# EAGLE design bottom (EAGLE 6.5.0)
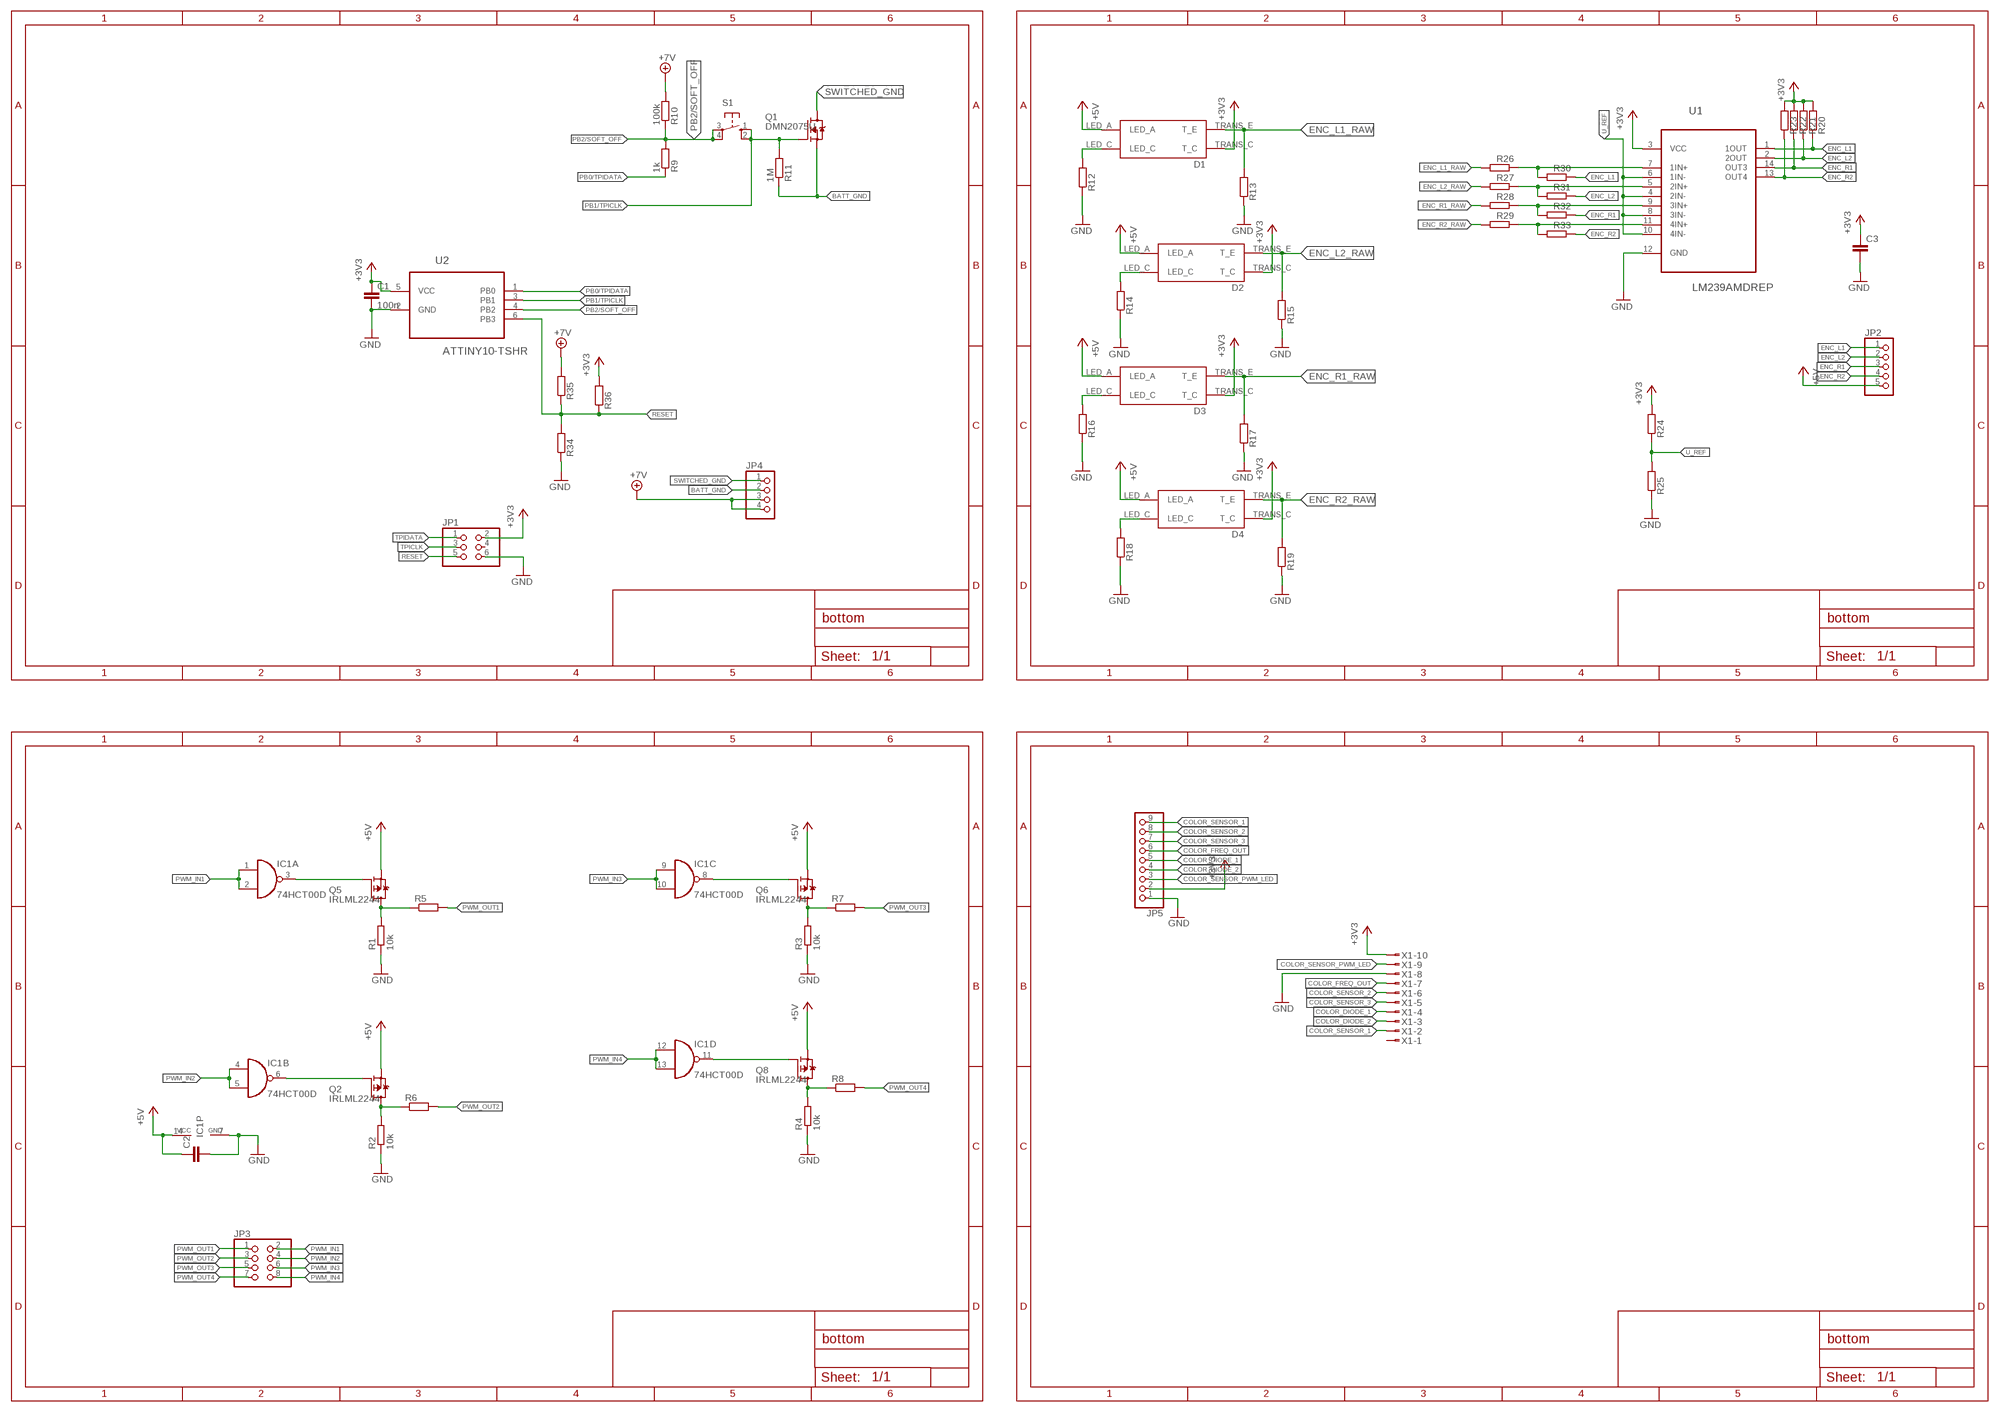
[diagram p0: schematic, sheet 1]

## Parts
C1  100n  C-EUC0603  [C0603]
C2  C-EUC0603  [C0603]
C3  C-EUC0603  [C0603]
D1  CNY70  [CNY70]
D2  CNY70  [CNY70]
D3  CNY70  [CNY70]
D4  CNY70  [CNY70]
IC1  74HCT00D  [SO14]
JP1  PINHD-2X3  [2X03]
JP2  PINHD-1X5  [1X05]
JP3  PINHD-2X4  [2X04]
JP4  PINHD-1X4  [1X04]
JP5  PINHD-1X9  [1X09]
Q1  DMN2075U  [SOT95P240X112-3N]
Q2  IRLML2244  [SOT95P240X112-3N]
Q5  IRLML2244  [SOT95P240X112-3N]
Q6  IRLML2244  [SOT95P240X112-3N]
Q8  IRLML2244  [SOT95P240X112-3N]
R1  10k  R-EU_R0603  [R0603]
R2  10k  R-EU_R0603  [R0603]
R3  10k  R-EU_R0603  [R0603]
R4  10k  R-EU_R0603  [R0603]
R5  R-EU_M0805  [M0805]
R6  R-EU_M0805  [M0805]
R7  R-EU_M0805  [M0805]
R8  R-EU_M0805  [M0805]
R9  1k  R-EU_M0805  [M0805]
R10  100k  R-EU_M0805  [M0805]
R11  1M  R-EU_M0805  [M0805]
R12  R-EU_R0805  [R0805]
R13  R-EU_M0805  [M0805]
R14  R-EU_M0805  [M0805]
R15  R-EU_M0805  [M0805]
R16  R-EU_M0805  [M0805]
R17  R-EU_M0805  [M0805]
R18  R-EU_M0805  [M0805]
R19  R-EU_M0805  [M0805]
R20  R-EU_M0805  [M0805]
R21  R-EU_M0805  [M0805]
R22  R-EU_M0805  [M0805]
R23  R-EU_M0805  [M0805]
R24  R-EU_M0805  [M0805]
R25  R-EU_M0805  [M0805]
R26  R-EU_M0805  [M0805]
R27  R-EU_M0805  [M0805]
R28  R-EU_M0805  [M0805]
R29  R-EU_M0805  [M0805]
R30  R-EU_M0805  [M0805]
R31  R-EU_M0805  [M0805]
R32  R-EU_M0805  [M0805]
R33  R-EU_M0805  [M0805]
R34  R-EU_M0805  [M0805]
R35  R-EU_M0805  [M0805]
R36  R-EU_M0805  [M0805]
S1  10-XX  [B3F-10XX]
U1  LM239AMDREP  [SOIC127P600X175-14N]
U2  ATTINY10-TSHR  [SOT95P280X145-6N]
X1  FTOP-10  [FTOP-10]

## Nets
+3V3: C1.1 C3.1 D1.TRANS_C(T_C) D2.TRANS_C(T_C) D3.TRANS_C(T_C) D4.TRANS_C(T_C) JP1.2 JP5.2 R20.2 R21.2 R22.2 R23.2 R24.2 R36.2 U1.3(VCC) U2.5(VCC) X1.10
+5V: C2.1 D1.LED_A D2.LED_A D3.LED_A D4.LED_A IC1.14(P:VCC) JP2.5 Q2.S Q5.S Q6.S Q8.S
+7V: JP4.3 JP4.4 R10.2 R35.2
BATT_GND: JP4.2 Q1.S R11.1
COLOR_DIODE_1: JP5.5 X1.4
COLOR_DIODE_2: JP5.4 X1.3
COLOR_FREQ_OUT: JP5.6 X1.7
COLOR_SENSOR_1: JP5.9 X1.2
COLOR_SENSOR_2: JP5.8 X1.6
COLOR_SENSOR_3: JP5.7 X1.5
COLOR_SENSOR_PWM_LED: JP5.3 X1.9
ENC_L1: JP2.1 R20.1 R30.1 U1.1(1OUT)
ENC_L1_RAW: D1.TRANS_E(T_E) R13.2 R26.2
ENC_L2: JP2.2 R21.1 R31.1 U1.2(2OUT)
ENC_L2_RAW: D2.TRANS_E(T_E) R15.2 R27.2
ENC_R1: JP2.3 R22.1 R32.1 U1.14(OUT3)
ENC_R1_RAW: D3.TRANS_E(T_E) R17.2 R28.2
ENC_R2: JP2.4 R23.1 R33.1 U1.13(OUT4)
ENC_R2_RAW: D4.TRANS_E(T_E) R19.2 R29.2
GND: C1.2 C2.2 C3.2 IC1.7(P:GND) JP1.6 JP5.1 R1.1 R2.1 R3.1 R4.1 R12.1 R13.1 R14.1 R15.1 R16.1 R17.1 R18.1 R19.1 R25.1 R34.1 U1.12(GND) U2.2(GND) X1.8
N$1: IC1.3(A:O) Q5.G
N$2: IC1.6(B:O) Q2.G
N$3: Q5.D R1.2 R5.1
N$4: IC1.8(C:O) Q6.G
N$5: IC1.11(D:O) Q8.G
N$13: Q8.D R4.2 R8.1
N$14: Q6.D R3.2 R7.1
N$15: Q2.D R2.2 R6.1
N$43: D1.LED_C R12.2
N$44: R26.1 R30.2 U1.7(1IN+)
N$45: R27.1 R31.2 U1.5(2IN+)
N$46: D2.LED_C R14.2
N$47: R28.1 R32.2 U1.9(3IN+)
N$48: D3.LED_C R16.2
N$49: R29.1 R33.2 U1.11(4IN+)
N$50: D4.LED_C R18.2
PB0/TPIDATA: R9.1 U2.1(PB0)
PB1/TPICLK: Q1.G R11.2 S1.1(S) S1.2(S1) U2.3(PB1)
PB2/SOFT_OFF: R9.2 R10.1 S1.3(P) S1.4(P1) U2.4(PB2)
PWM_IN1: IC1.1(A:I0) IC1.2(A:I1) JP3.2
PWM_IN2: IC1.4(B:I0) IC1.5(B:I1) JP3.4
PWM_IN3: IC1.9(C:I0) IC1.10(C:I1) JP3.6
PWM_IN4: IC1.12(D:I0) IC1.13(D:I1) JP3.8
PWM_OUT1: JP3.1 R5.2
PWM_OUT2: JP3.3 R6.2
PWM_OUT3: JP3.5 R7.2
PWM_OUT4: JP3.7 R8.2
RESET: JP1.5 R34.2 R35.1 R36.1 U2.6(PB3)
SWITCHED_GND: JP4.1 Q1.D
TPICLK: JP1.3
TPIDATA: JP1.1
U_REF: R24.1 R25.2 U1.4(2IN-) U1.6(1IN-) U1.8(3IN-) U1.10(4IN-)
Unconnected: JP1.4 X1.1

## Library data of the parts
C1-C3 = rcl:C-EU: CAPACITOR, European symbol
D1-D4 = BEEP:CNY70
IC1 = 74xx-eu:74*00: Quad 2-input NAND gate
JP1 = pinhead:PINHD-2X3: PIN HEADER
JP2 = pinhead:PINHD-1X5: PIN HEADER
JP3 = pinhead:PINHD-2X4: PIN HEADER
JP4 = pinhead:PINHD-1X4: PIN HEADER
JP5 = pinhead:PINHD-1X9: PIN HEADER
Q1 = BEEP:DMN2075U
Q2 Q5 Q6 Q8 = BEEP:IRLML2244: OptiMOS(R)-P Small-Signal-Transistor P-Channel, Enhancement mode, Super Logic Level (2.5 V rated) Source: http://www.infineon.com/upload/Document/BSA223SP_Rev1.3.pdf
R1-R36 = rcl:R-EU_: RESISTOR, European symbol
S1 = switch-omron:10-XX: OMRON SWITCH; MPN: B3F-1000; OC_FARNELL: 176432; OC_NEWARK: 36M3542
U1 = Texas Instruments_By_element14_Batch_1:LM239AMDREP: QUAD DIFFERENTIAL COMPARATORS; MPN: LM239AMDREP; OC_FARNELL: -; OC_NEWARK: 79R8092; PACKAGE: SOIC-14; SUPPLIER: Texas Instruments
U2 = Atmel_By_element14_Batch_1:ATTINY10-TSHR: 8-bit Microcontroller with In-System Programmable Flash; MPN: ATTINY10-TSHR; OC_FARNELL: 1748538; OC_NEWARK: 26R5645; PACKAGE: SOT-23-6; SUPPLIER: Atmel
X1 = con-ftop-orientation-hole:FTOP-10: AMP connector

## Board
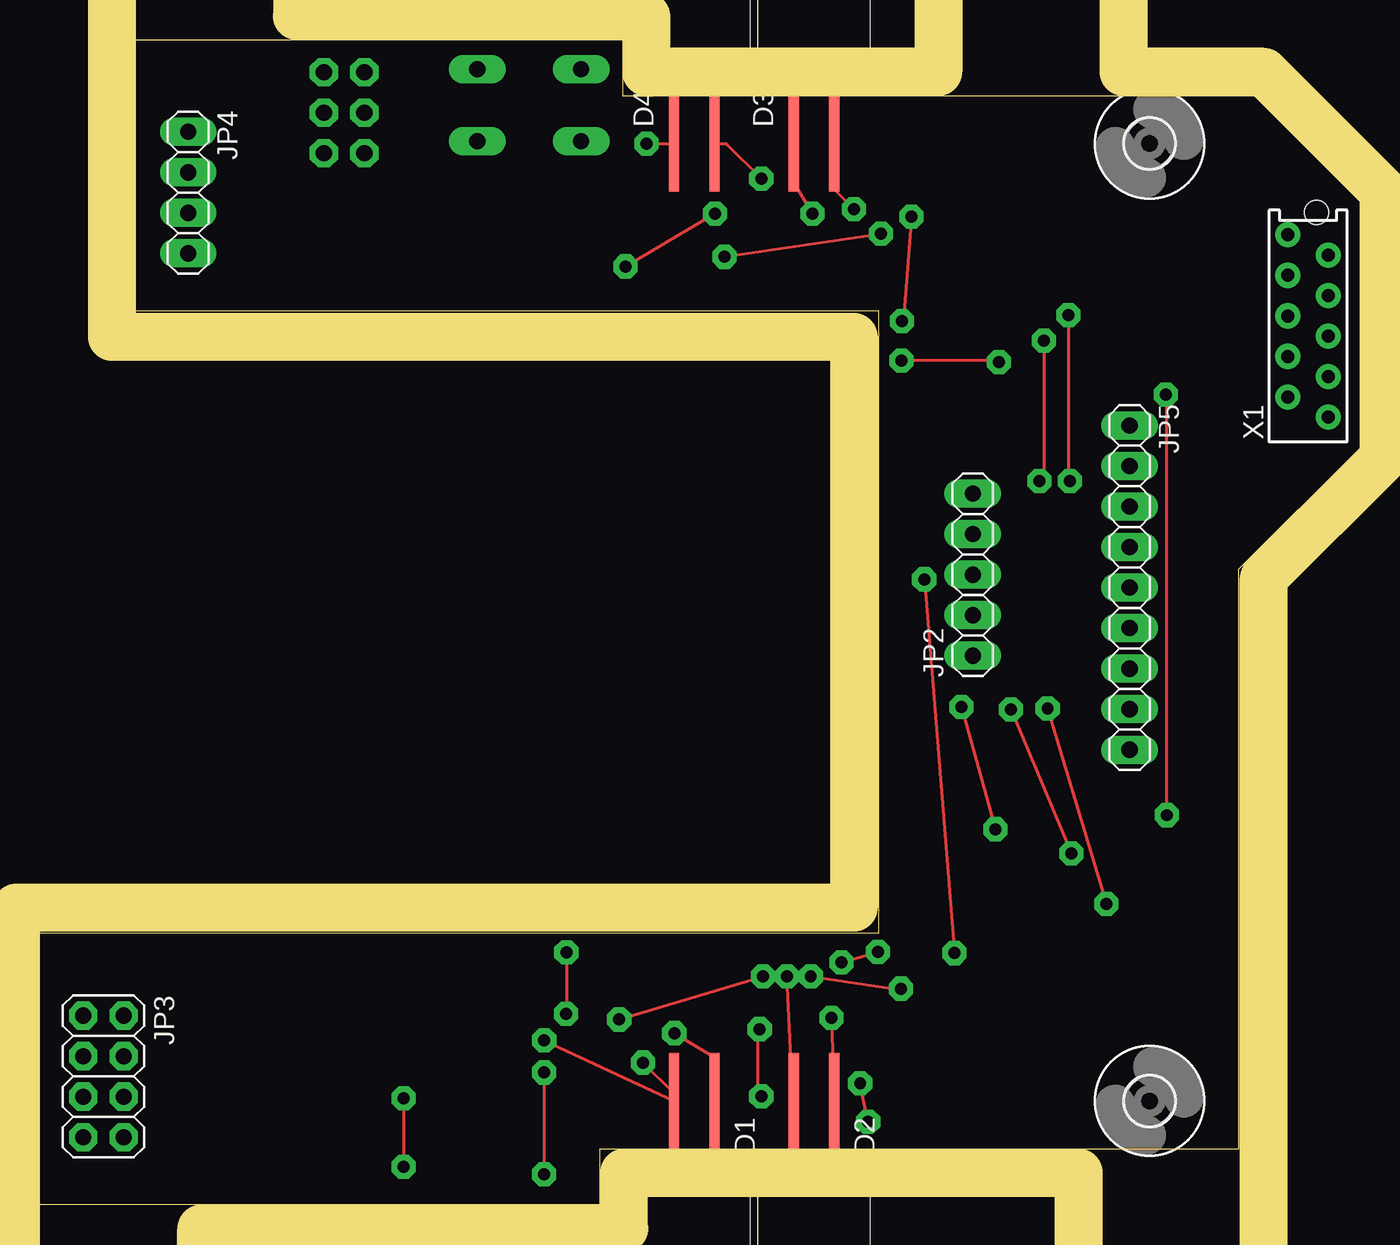
[diagram p1: board, top side]
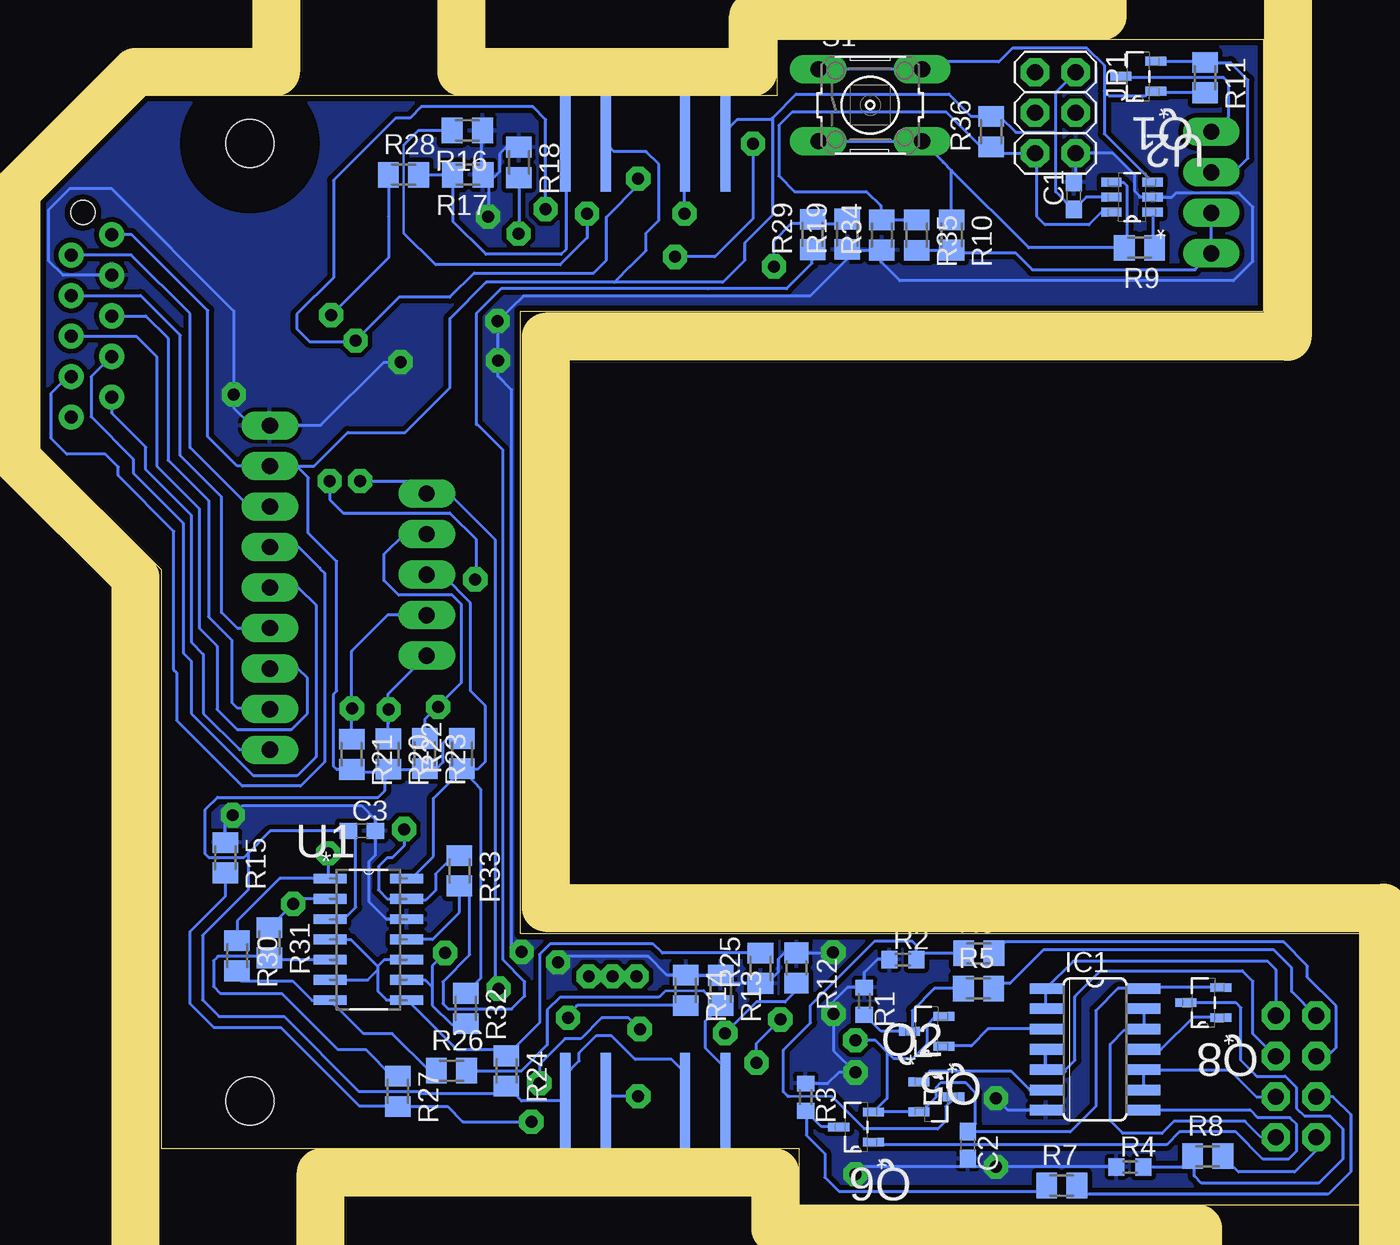
[diagram p2: board, bottom side, seen from below]

Size 82.71 x 73 mm. Coordinates in mm from the lower left corner, seen from the top.
Outline: 35.11,0 0,0 0,17 52.6,17 52.6,56 6,56 6,73 36.51,73 36.51,69.5 76.11,69.5 82.71,62.9 82.71,47.4 75.11,39.8 75.11,3.5 35.11,3.5 35.11,0
Copper layers (1*16): Top 0.035mm / dielectric 1.5mm / Bottom 0.035mm
Design rules "default *": minimum track width 8mil, minimum drill 24mil, track to track 8mil, track to pad 8mil, pad to pad 8mil, via to via 8mil, smd to smd 8mil, copper to edge 15mil, drill to drill 8mil, minimum pad ring 15mil, minimum via ring 15mil, stop-mask expansion 4mil, vias tented up to drill 0mil, thermal gap 10mil
Milling: 21 lines

### Footprints (pad centres in the part's own frame; a part is rotated, then mirrored left to right if it is on the bottom)
C0603 = smd 1.1 x 1: 1 -0.85,0; 2 0.85,0
CNY70 = smd 6 x 0.635: LED_A 3,1.27; LED_C 3,-1.27 | smd 6 x 0.635 bottom: TRANS_C 3,-1.27; TRANS_E 3,1.27
SO14 = smd 0.66 x 2.032: 1 -3.81,-3.073; 2 -2.54,-3.073; 3 -1.27,-3.073; 4 0,-3.073; 5 1.27,-3.073; 6 2.54,-3.073; 7 3.81,-3.073; 8 3.81,3.073; 9 2.54,3.073; 10 1.27,3.073; 11 0,3.073; 12 -1.27,3.073; 13 -2.54,3.073; 14 -3.81,3.073
2X03 = drill 1.016 octagon: 1 -2.54,-1.27; 2 -2.54,1.27; 3 0,-1.27; 4 0,1.27; 5 2.54,-1.27; 6 2.54,1.27
1X05 = drill 1.016 long: 1 -5.08,0; 2 -2.54,0; 3 0,0; 4 2.54,0; 5 5.08,0
2X04 = drill 1.016 octagon: 1 -3.81,-1.27; 2 -3.81,1.27; 3 -1.27,-1.27; 4 -1.27,1.27; 5 1.27,-1.27; 6 1.27,1.27; 7 3.81,-1.27; 8 3.81,1.27
1X04 = drill 1.016 long: 1 -3.81,0; 2 -1.27,0; 3 1.27,0; 4 3.81,0
1X09 = drill 1.016 long: 1 -10.16,0; 2 -7.62,0; 3 -5.08,0; 4 -2.54,0; 5 0,0; 6 2.54,0; 7 5.08,0; 8 7.62,0; 9 10.16,0
SOT95P240X112-3N = smd 1.321 x 0.559: D 1.092,0; G -1.092,0.94; S -1.092,-0.94
R0603 = smd 1 x 1.1: 1 -0.85,0; 2 0.85,0
M0805 = smd 1.3 x 1.6: 1 -0.95,0; 2 0.95,0
R0805 = smd 1.3 x 1.5: 1 -0.95,0; 2 0.95,0
B3F-10XX = drill 1.016 long: 1 -3.251,2.261; 2 3.251,2.261; 3 -3.251,-2.261; 4 3.251,-2.261
SOIC127P600X175-14N = smd 2.057 x 0.61: 1 -4.801,7.62; 2 -4.801,6.35; 3 -4.801,5.08; 4 -4.801,3.81; 5 -4.801,2.54; 6 -4.801,1.27; 7 -4.801,0; 8 0,0; 9 0,1.27; 10 0,2.54; 11 0,3.81; 12 0,5.08; 13 0,6.35; 14 0,7.62
SOT95P280X145-6N = smd 1.27 x 0.559: 1 -1.295,0.94; 2 -1.295,0; 3 -1.295,-0.94; 4 1.295,-0.94; 5 1.295,0; 6 1.295,0.94
3,0 = hole 3: 0,0
FTOP-10 = drill 0.813: 1 -5.715,-1.27; 2 -4.445,1.27; 3 -3.175,-1.27; 4 -1.905,1.27; 5 -0.635,-1.27; 6 0.635,1.27; 7 1.905,-1.27; 8 3.175,1.27; 9 4.445,-1.27; 10 5.715,1.27 | hole 1.5: 7.115,-0.53

### Placement (x,y rotation side)
C1  17.91,63.22 90 bottom
C2  24.56,3.73 270 bottom
C3  62.53,23.42 0 bottom
D1  41.01,3.5 90 top
D2  48.51,3.5 90 top
D3  48.51,69.5 270 top
D4  41.01,69.5 270 top
IC1  16.58,9.73 270 bottom
JP1  19.07,68.44 270 bottom
JP2  58.47,39.48 90 top
JP3  3.99,8.03 270 top
JP4  9.29,63.43 270 top
JP5  68.3,38.67 270 top
Q1  13.87,70.71 180 bottom
Q2  26.53,6.75 0 bottom
Q5  27.13,10.86 180 bottom
Q6  31.56,4.86 180 bottom
Q8  9.8,12.66 180 bottom
R1  31.04,12.75 270 bottom
R2  28.62,15.37 0 bottom
R3  34.72,6.74 270 bottom
R4  14.39,2.36 0 bottom
R5  23.89,13.55 0 bottom
R6  23.87,15.75 0 bottom
R7  18.67,1.2 0 bottom
R8  9.52,3.04 0 bottom
R9  13.8,59.97 180 bottom
R10  25.57,60.77 270 bottom
R11  9.68,70.63 270 bottom
R12  35.29,14.83 270 bottom
R13  40.04,13.42 270 bottom
R14  42.23,13.43 270 bottom
R15  71.08,21.74 270 bottom
R16  55.92,67.32 180 bottom
R17  55.89,64.55 180 bottom
R18  52.68,65.32 270 bottom
R19  32.11,60.81 90 bottom
R20  60.87,28.23 270 bottom
R21  63.17,28.22 270 bottom
R22  56.26,28.27 90 bottom
R23  58.58,28.27 270 bottom
R24  53.47,8.38 270 bottom
R25  37.55,14.81 90 bottom
R26  56.91,8.39 0 bottom
R27  60.27,7.1 270 bottom
R28  59.92,64.55 0 bottom
R29  34.28,60.8 90 bottom
R30  70.35,15.6 270 bottom
R31  68.32,16.42 270 bottom
R32  56.02,12.3 270 bottom
R33  56.41,20.92 270 bottom
R34  29.94,60.77 90 bottom
R35  27.77,60.76 270 bottom
R36  23.1,67.25 90 bottom
S1  30.67,68.91 0 bottom
U1  59.72,12.81 0 bottom
U2  14.27,63.14 180 bottom
U$1  [3,0]  69.54,6.5 0 top
U$2  [3,0]  69.54,66.5 0 top
X1  79.48,55.07 90 top

### Tracks (layer width: path | path; a pad name or v marks a point on that pad's centre or on a via)
+3V3
  Bottom 0.203: 46.71,57.81 39.9,57.81 38.51,59.2 38.51,60.3 36.81,62 36.81,68 | 46.71,57.81 54.74,57.81 57.01,55.54 57.01,51.2 59.81,48.4 63.41,48.4 65.52,46.29 66.62,46.29 | X1.10 78.19,60.81 76.96,60.81 72.19,56.03 72.19,48.13 70.34,46.29 JP5.2 66.62,46.29 | U2.5 17.13,63.14 C1.1 17.95,62.37 19.05,63.48 19.05,67.2 | 19.05,67.2 19.05,69.72 JP1.2 | 66.62,46.29 65.89,45.56 65.89,42.09 64.11,40.31 64.11,32.2 64.29,32.02 64.29,27.46 64.1,27.27 R21.2 62.97,27.07 61.09,27.07 | 53.09,7.06 R24.2 | U1.3 63.67,17.89 62.91,18.64 62.91,22.95 C3.1 68.27,23.42 69.67,22.02 | 61.09,27.07 61.09,25.96 61.52,25.53 71.58,25.53 72.34,24.77 72.34,21.97 72.11,21.74 69.95,21.74 69.67,22.02 | 61.09,27.07 R20.2 58.61,27.29 R23.2 57.85,27.32 57.43,27.74 57.43,28.93 57.15,29.21 56.36,29.21 R22.2 | 69.67,22.02 69.67,19.71 72.52,16.87 72.52,12.83 71.48,11.79 67.41,11.79 62.73,7.1 59.02,7.1 58.85,6.93 53.96,6.93 R24.2 | 19.05,67.2 21.55,67.2 22.55,68.2 R36.2 24.33,68.2 25.73,69.6 35.31,69.6 36.81,68.1 36.81,68 | 46.71,57.81 45.71,58.81 45.7,58.81 44.71,59.8 44.71,60.9 43.91,61.7 43.91,65.2 44.71,66 46.74,66 D3.TRANS_C | 36.81,68 39.01,68 39.71,67.3 39.71,66.53 D4.TRANS_C | D1.TRANS_C 42.31,6.53 42.31,8.3 43.11,9.1 45.41,9.1 46.91,10.6 47.81,10.6 48.91,9.5 48.91,9 49.81,8.1 49.81,6.53 D2.TRANS_C 52.53,6.5 R24.2
+5V  (via drill 0.75)
  Top 0.203: v62.91,54.15 62.91,45.62 v62.64,45.34 | 53.95,13.51 v53.97,13.54 53.81,13.5 v48.31,14.3 | D3.LED_A 49.78,63.63 v51.01,62.4 | D4.LED_A 43.01,66.5 v45.21,64.3 | D1.LED_A 39.5,6.5 | v31.61,10.3 D1.LED_A | 47.31,6.57 D2.LED_A 47.21,6.53 v46.81,14.3 | D1.LED_A 39.74,6.97 v37.81,8.9 | v36.31,11.6 v45.31,14.3
  Bottom 0.203: IC1.14 14.55,13.54 | 14.55,13.54 15.14,13.54 16.53,12.15 16.53,6.15 18.13,4.55 24.53,4.55 C2.1 24.08,5.07 24.08,7.02 24.71,7.65 26.23,7.65 26.53,7.35 26.53,6.75 27.47,5.81 Q2.S 30.45,5.81 Q6.S | 30.41,5.75 Q6.S | Q5.S 26.58,11.8 27.13,11.25 27.13,10.05 28.03,9.15 29.2,9.15 29.61,9.56 | Q6.S 30.69,5.8 | Q8.S 14.49,13.6 14.55,13.54 | 29.61,9.56 29.61,6.66 Q6.S | v62.64,45.34 59.24,45.34 JP2.5 57.06,44.56 54.18,41.68 54.18,13.74 v53.97,13.54 | v51.01,62.4 51.01,68 51.81,68.8 58.81,68.8 59.51,68.1 60.41,68.1 64.31,64.2 64.31,58.1 66.61,55.8 66.61,54.9 65.81,54.1 62.97,54.1 v62.91,54.15 60.2,56.87 57.02,56.87 55.5,58.4 48.02,58.4 47.21,59.2 47.21,61.9 45.21,63.9 v45.21,64.3 | 29.61,9.56 30.35,10.3 v31.61,10.3 | v48.31,14.3 v46.81,14.3 v45.31,14.3 | v37.81,8.9 37.81,10.1 v36.31,11.6
+7V
  Bottom 0.203: JP4.3 JP4.4 10.31,58.6 20.51,58.6 21.53,59.62 25.37,59.62 R10.2 25.59,59.81 R35.2 27.76,59.82
BATT_GND
  Bottom 0.203: Q1.S 9.75,71.65 R11.1 8.09,71.58 6.99,70.48 6.99,65.58 7.88,64.7 JP4.2
COLOR_DIODE_1
  Bottom 0.203: JP5.5 66.51,38.67 65.4,37.57 65.4,28.07 66.6,26.87 69.32,26.87 73.23,30.79 73.23,34.06 73.71,34.54 73.71,42.7 76.83,45.82 76.83,46.71 79.5,49.38 79.5,51.89 78.23,53.16 X1.4
COLOR_DIODE_2
  Bottom 0.203: JP5.4 66.48,41.21 65.18,39.9 65.18,39.88 64.87,39.57 64.87,27.74 66.37,26.24 70.03,26.24 74.14,30.35 74.14,33.35 74.31,33.52 74.31,42.2 77.8,45.69 77.8,46.23 78.61,47.04 81.03,47.04 82.04,48.06 82.04,50.83 80.98,51.89 X1.3
COLOR_FREQ_OUT
  Bottom 0.203: X1.7 76.4,56.97 73.91,54.48 73.91,46.94 71.32,44.35 71.32,37.11 70.36,36.14 68.31,36.14 JP5.6
COLOR_SENSOR_1
  Bottom 0.203: JP5.9 68.31,28.52 70.2,28.52 72.47,30.79 72.47,34.49 73.21,35.24 73.21,43.2 76.07,46.06 76.07,47.47 78.21,49.61 X1.2
COLOR_SENSOR_2
  Bottom 0.203: X1.6 76.07,55.7 74.68,54.3 74.68,46.66 72.14,44.12 72.14,36.83 70.69,35.38 70.69,31.47 70.33,31.11 68.36,31.11 JP5.8
COLOR_SENSOR_3
  Bottom 0.203: X1.5 76.68,54.43 75.39,53.14 75.39,46.28 72.71,43.6 72.71,36.11 71.6,35 71.6,31.04 70.36,29.79 66.93,29.79 65.94,30.79 65.94,32.99 66.5,33.55 68.26,33.55 JP5.7
COLOR_SENSOR_PWM_LED
  Bottom 0.203: JP5.3 69.61,43.75 73.3,47.45 73.3,55.83 76.99,59.51 X1.9
ENC_L1  (via drill 0.75)
  Top 0.203: v60.86,31.04 v64.64,22.01
  Bottom 0.203: JP2.1 60.87,32 R20.1 v60.86,31.04 | R30.1 70.33,17.03 70.33,17.78 67.68,20.43 U1.1 64.64,20.55 v64.64,22.01
ENC_L1_RAW
  Bottom 0.152: 41.11,13.4 43.51,13.4 43.61,13.3
  Bottom 0.203: R26.2 52.52,8.39 50.91,10 50.91,12.2 50.11,13 43.91,13 43.61,13.3 | 39.74,12.17 R13.2 | R13.2 40.18,12.47 41.11,13.4 | D1.TRANS_E 39.74,8.53 41.01,9.8 41.01,11.51 R13.2
ENC_L2  (via drill 0.75)
  Top 0.203: v63.16,31.1 v66.84,18.84
  Bottom 0.203: U1.2 66.52,19.16 v66.84,18.84 R31.1 | v63.16,31.1 63.17,30.66 R21.1 63.17,34.69 63.17,34.7 60.93,36.94 JP2.2
ENC_L2_RAW  (via drill 0.75)
  Top 0.203: v45.21,6.8 45.01,7 45.01,10.9 v45.11,11 | v51.91,5.2 v51.41,7.6
  Bottom 0.203: R15.2 71.08,19.33 73.31,17.1 73.31,12.6 71.81,11.1 67.61,11.1 62.71,6.2 60.32,6.2 R27.2 57.16,6.15 56.21,5.2 v51.91,5.2 | v45.21,6.8 46.94,6.8 D2.TRANS_E | v45.11,11 45.81,11.7 47.51,11.7 48.81,10.4 49.81,10.4 51.41,8.8 v51.41,7.6
ENC_R1
  Bottom 0.203: U1.14 59.58,20.3 58.04,21.84 58.04,25.46 56.36,27.14 R22.1 | R22.1 55.09,26.05 55.09,14.18 R32.1 | R22.1 55.23,27.32 54.79,27.76 54.79,31.27 55.73,32.21 55.73,37.72 57.45,39.45 58.43,39.45 JP2.3
ENC_R1_RAW
  Bottom 0.203: D3.TRANS_E 49.71,66.43 49.71,59.9 50.05,59.56 54.75,59.56 56.84,61.65 R17.2 R28.2
ENC_R2  (via drill 0.75)
  Top 0.203: v57.75,31.19 v59.89,23.53
  Bottom 0.203: R23.1 58.57,30.43 57.81,31.19 | 57.81,31.19 56.29,32.72 56.29,37.62 56.87,38.2 60.22,38.2 61.14,39.12 61.14,40.77 59.87,42.04 58.48,42.04 JP2.4 | R33.1 56.82,21.46 57.17,21.46 57.91,20.72 57.91,19.69 58.51,19.1 59.66,19.1 U1.13 60.93,19.15 61.49,19.71 61.49,21.18 60.93,21.74 60.62,21.74 59.89,22.47 v59.89,23.53 | v57.75,31.19 57.81,31.19
ENC_R2_RAW  (via drill 0.75)
  Top 0.203: v42.31,62.1 v36.71,58.8
  Bottom 0.203: R19.2 32.46,61.41 32.49,61.44 33.97,61.44 R29.2 34.54,61.5 35.61,61.5 36.71,60.4 v36.71,58.8 | v42.31,62.1 42.31,66.47 D4.TRANS_E
GND  (via drill 0.75)
  Top 0.203: v22.79,6.65 v22.79,2.36 | v31.6,8.28 v31.6,1.91 | v32.99,15.8 32.99,11.99 v32.97,11.96 | v54.63,61.92 54.13,55.47 v54.02,55.37 | 54.1,52.81 v54,52.91 60,52.91 v60.11,52.8 | v70.64,24.41 70.64,50.7 v70.56,50.77 | v50.24,15.19 v52.53,15.85
  Bottom 0.203: R4.1 v22.79,2.36 24.66,2.36 | R3.1 33.34,7.59 32.62,8.31 v31.6,8.28 32.97,9.65 v32.97,11.96 32.97,12.73 32.09,13.6 R1.1 31.04,14.56 30.23,15.37 R2.1 | IC1.7 22.06,5.92 v22.79,6.65 | 24.66,2.36 31.14,2.36 v31.6,1.91 | R18.1 53.48,66.27 53.89,65.86 53.89,64.75 54.22,64.41 54.6,64.41 | 54.6,64.41 55.13,64.41 R17.1 55.03,64.64 55.03,67.25 R16.1 | 32.16,59.7 32.16,59.81 R19.1 32.05,59.8 31.61,59.8 | 37.53,13.84 R25.1 | 54.6,64.41 54.6,61.95 v54.63,61.92 | R25.1 39.53,13.86 R13.1 R14.1 43.41,14.38 44.58,15.54 49.58,15.54 v50.24,15.19 | X1.8 81.25,58.24 82.14,59.13 82.14,62.37 80.81,63.7 78.25,63.7 70.56,56.01 v70.56,50.77 70.56,49.94 69.47,48.84 68.31,48.84 | 68.31,48.84 JP5.1 | 68.31,48.84 65.1,48.84 61.14,52.8 v60.11,52.8 | C2.2 24.56,2.46 24.66,2.36 | U1.12 60.99,17.89 62.1,19 62.1,21.49 61.7,21.89 61.7,22.9 C3.2 61.7,22.92 61.7,24.16 62.56,25.02 70,25.02 70.61,24.41 v70.64,24.41 71.08,23.96 R15.1 | v52.53,15.85 53.14,15.72 53.14,51.05 54,51.92 v54,52.91 54,55.35 v54.02,55.37 52.4,56.95 34.46,56.95 31.61,59.8 | 29.99,59.86 R34.1 30.01,59.75 | C1.2 17.8,64.18 JP1.6 15.47,65.89 14.1,64.52 14.1,63.52 13.79,63.22 13.79,63.14 U2.2 11.77,63.14 11.51,63.4 11.5,63.39 7.57,63.39 6.69,62.52 6.69,59.12 7.91,57.9 28.81,57.9 30.01,59.1 30.01,59.75 | 30.01,59.75 30.06,59.75 30.11,59.8 31.61,59.8 | v32.99,15.8 33.01,15.78 R12.1 35.4,15.8 36.01,15.8 36.41,15.4 36.41,14.6 37.15,13.86 R25.1
  pour Bottom (isolate 0.305): -3.59,79.6 85.91,79.6 85.91,-3.6 -3.59,-3.6
N$1
  Bottom 0.203: IC1.3 23.28,11 24.33,9.95 26.01,9.95 Q5.G
N$2
  Bottom 0.203: IC1.6 20.67,7.19 21.83,8.35 26.96,8.35 Q2.G
N$3
  Bottom 0.203: R5.1 26.63,13.55 28.03,12.15 28.03,11.05 Q5.D 30,10.86 R1.2
N$4
  Bottom 0.203: IC1.8 13.48,5.95 6.87,5.95 6.37,5.45 4.37,5.45 3.96,5.05 3.96,3.35 4.46,2.85 6.06,2.85 7.76,4.55 11.3,4.55 12.1,3.75 30.29,3.75 Q6.G
N$5
  Bottom 0.203: IC1.11 12.45,9.73 10.43,11.75 9.24,11.75 Q8.G
N$13
  Bottom 0.203: R4.2 11.15,2.36 R8.1 10.36,2.93 10.36,1.8 9.91,1.35 2.56,1.35 1.06,2.85 1.06,4.75 1.87,5.55 3.46,5.55 3.96,6.05 3.96,7.35 4.67,8.05 6.47,8.05 6.47,8.07 7.44,9.04 7.44,12.34 7.76,12.66 Q8.D
N$14
  Bottom 0.203: 34.71,5.75 R3.2 34.67,5.84 | Q6.D 33.72,4.89 34.67,5.84 | R7.1 19.65,1.2 20.04,0.81 32.61,0.81 33.51,1.71 33.51,3.2 34.67,4.36 34.67,5.84
N$15
  Bottom 0.203: R6.1 28.15,15.75 R2.2 27.77,16.24 28.04,16.51 30.4,16.51 34.41,12.5 34.41,11.4 36.12,9.69 36.12,7.06 35.84,6.78 35.76,6.78 33.04,6.76 31.04,4.75 26.43,4.75 25.93,5.25 25.93,6.15 25.44,6.64 Q2.D
N$43  (via drill 0.75)
  Top 0.203: 42.31,9.4 42.31,9.2 42.28,9.23 | D1.LED_C 42.28,9.23 | v39.76,10.75 42.28,9.23
  Bottom 0.203: R12.2 35.41,13.86 35.41,13.3 36.01,12.7 37.81,12.7 v39.76,10.75
N$44
  Bottom 0.203: R26.1 58.3,8.39 60.63,10.72 62.43,10.72 U1.7 65.66,12.8 66.88,14.02 70.08,14.02 70.4,14.35 R30.2
N$45
  Bottom 0.203: U1.5 68.2,15.35 | 68.2,15.35 R31.2 | 68.2,15.35 68.95,15.35 69.16,15.57 71.55,15.57 71.83,15.29 71.83,13.66 71.4,13.23 67.56,13.23 64.03,9.7 62.28,9.7 60.63,8.05 R27.1
N$46  (via drill 0.75)
  Top 0.203: v49.61,11.7 D2.LED_C
  Bottom 0.203: R14.2 49.03,12.48 v49.61,11.7
N$47  (via drill 0.75)
  Top 0.203: v64.46,55.75 64.46,45.41 v64.54,45.34 | v55.42,39.19 v57.31,15.77
  Bottom 0.203: R28.1 60.87,61.93 | 60.87,61.93 60.88,61.92 | 60.87,61.93 60.87,59.35 v64.46,55.75 | U1.9 58.56,14.08 58.11,13.64 | R32.2 56.07,11.3 56.92,11.3 58.11,12.5 58.11,13.64 | v64.54,45.34 64.54,44.2 63.7,43.36 57.02,43.36 55.37,41.71 55.37,39.24 v55.42,39.19 | v57.31,15.77 58.11,14.96 58.11,13.64
N$48  (via drill 0.75)
  Top 0.203: D3.LED_C 47.24,64.1 | 47.24,64.1 47.24,63.63 47.21,63.6 | v48.41,62.1 47.24,64.1
  Bottom 0.152: 59.91,60.9 59.91,66.4
  Bottom 0.203: 59.91,60.9 57.91,58.9 50.11,58.9 48.41,60.6 v48.41,62.1 | R16.2 58.99,67.32 59.91,66.4
N$49
  Bottom 0.203: 55.37,48.97 55.37,55.85 53.82,57.4 40.83,57.4 40.82,57.4 35.91,57.4 34.31,59 34.31,59.83 R29.1 | 55.37,48.97 55.37,48.87 | 55.37,48.97 53.7,47.3 53.7,15.34 52.32,13.97 52.32,13.08 53.14,12.27 57.12,12.27 57.45,12.6 57.45,13.97 55.77,15.66 55.77,19.89 55.84,19.97 R33.2 56.41,18.32 58.11,16.62 U1.11
N$50  (via drill 0.75)
  Top 0.203: v42.91,59.4 v52.71,60.86 | v38.01,66.5 D4.LED_C
  Bottom 0.203: R18.2 52.68,61.63 v52.71,60.86 | v42.91,59.4 40.41,59.4 38.01,61.8 v38.01,66.5
PB0/TPIDATA
  Bottom 0.203: U2.1 12.97,59.5 R9.1
PB1/TPICLK
  Bottom 0.203: R11.2 12.7,69.68 | 12.7,69.68 Q1.G | 12.7,69.68 13.27,69.68 13.47,69.48 15.69,69.48 16.01,69.8 | S1.1 S1.2 26.96,71.63 22.61,71.63 21.74,72.5 17.11,72.5 16.01,71.4 16.01,69.8 | 16.01,69.8 16.01,67.11 U2.3
PB2/SOFT_OFF
  Bottom 0.203: U2.4 14.8,64.08 14.58,63.86 14.58,60.2 14.85,59.93 14.85,59.47 R9.2 20.74,59.97 25.57,64.81 | S1.3 S1.4 26.09,65.32 25.57,64.81 | R10.1 25.57,64.81
PWM_IN1
  Bottom 0.203: IC1.2 IC1.1 17.95,15.25 5.77,15.25 5.25,14.74 JP3.2
PWM_IN2
  Bottom 0.203: IC1.5 IC1.4 19.74,8.35 18.43,8.35 18.43,8.45 17.83,9.05 17.83,13.05 16.23,14.65 7.34,14.65 6.68,13.99 6.68,10.69 5.29,9.3 JP3.4
PWM_IN3
  Bottom 0.203: IC1.9 IC1.10 8.16,8.45 6.47,6.76 JP3.6
PWM_IN4
  Bottom 0.203: IC1.13 IC1.12 13.56,10.95 14.73,10.95 15.63,10.05 15.63,5.25 14.85,4.47 12.39,4.47 11.63,5.23 7.19,5.23 6.18,4.22 JP3.8
PWM_OUT1
  Bottom 0.203: R5.2 22.63,13.85 21.92,13.85 19.83,15.95 5.37,15.95 4.26,14.85 4.26,13.35 2.75,11.84 JP3.1
PWM_OUT2
  Bottom 0.203: R6.2 22.21,16.45 4.76,16.45 3.26,14.95 3.26,14.25 1.46,12.45 1.46,9.85 2.01,9.3 JP3.3
PWM_OUT3
  Bottom 0.203: JP3.5 1.67,6.76 0.56,5.65 0.56,2.05 1.96,0.65 17.17,0.65 R7.2
PWM_OUT4
  Bottom 0.203: JP3.7 2.71,3.4 4.06,2.05 7.59,2.05 R8.2
RESET
  Bottom 0.203: U2.6 16.18,62.2 16.97,61.42 19.71,61.42 20.24,61.95 20.24,65.8 JP1.5 22.7,65.89 R36.1 23.73,66.3 25.88,68.45 35.59,68.45 36.4,67.64 36.4,64.49 35.41,63.5 30.91,63.5 30.01,62.6 30.01,61.79 R34.2 R35.1
SWITCHED_GND
  Bottom 0.203: 14.9,70.64 Q1.D 14.88,70.62 8.53,70.62 8.21,70.31 8.21,68.2 9.17,67.24 JP4.1
U_REF
  Bottom 0.203: R25.2 43.7,15.76 44.27,16.33 50.75,16.33 51.41,15.67 51.41,11.39 R24.1 53.86,9.73 56.59,9.73 59.67,12.81 U1.8 59.73,12.83 60.98,12.83 61.54,13.39 61.54,14.71 | U1.10 61.13,15.35 61.54,14.94 | 61.54,14.94 61.54,14.71 | U1.4 63.23,16.62 61.54,14.94 | U1.6 62.17,14.08 61.54,14.71